# Altium schematic sheet klor1_4_L.SchDoc
size 297 x 209 mm
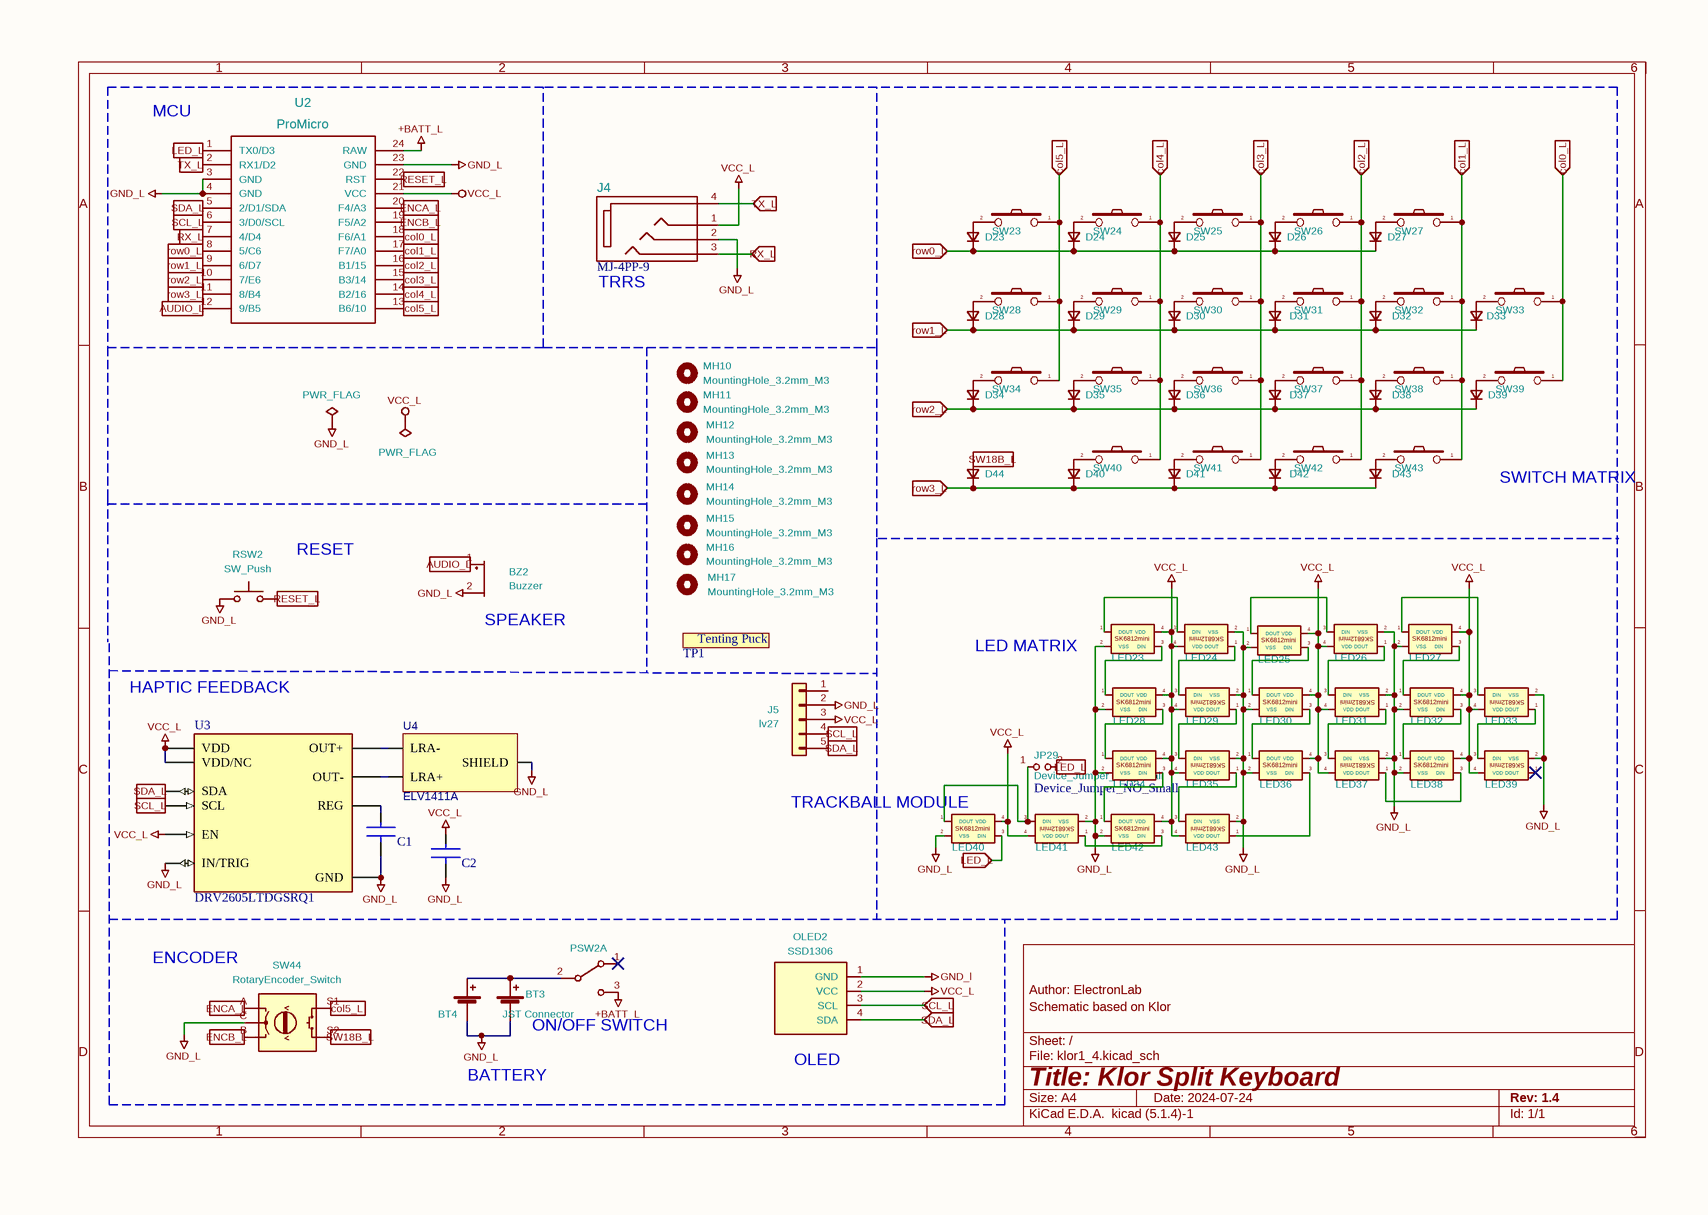
[diagram p0: klor1_4_L.SchDoc]

## Parts
#FLG01  PWR_FLAG  (graphical)
#FLG02  PWR_FLAG  (graphical)
BT3  JST Connector  [JST_PH_2PINS]
BT4  Battery_Cell  [custombatteryconnector_small]  (value not drawn)
BZ2  Buzzer  [Buzzer_Mallory_AST1109MLTRQ_reversible]
C1  Capacitor  [FP-C0402-BB-MFG]  (value not drawn)
C2  Capacitor  [FP-C0402-BB-MFG]  (value not drawn)
D23  D_Small  [Diode_SOD123]  (value not drawn)
D24  D_Small  [Diode_SOD123]  (value not drawn)
D25  D_Small  [Diode_SOD123]  (value not drawn)
D26  D_Small  [Diode_SOD123]  (value not drawn)
D27  D_Small  [Diode_SOD123]  (value not drawn)
D28  D_Small  [Diode_SOD123]  (value not drawn)
D29  D_Small  [Diode_SOD123]  (value not drawn)
D30  D_Small  [Diode_SOD123]  (value not drawn)
D31  D_Small  [Diode_SOD123]  (value not drawn)
D32  D_Small  [Diode_SOD123]  (value not drawn)
D33  D_Small  [Diode_SOD123]  (value not drawn)
D34  D_Small  [Diode_SOD123]  (value not drawn)
D35  D_Small  [Diode_SOD123]  (value not drawn)
D36  D_Small  [Diode_SOD123]  (value not drawn)
D37  D_Small  [Diode_SOD123]  (value not drawn)
D38  D_Small  [Diode_SOD123]  (value not drawn)
D39  D_Small  [Diode_SOD123]  (value not drawn)
D40  D_Small  [Diode_SOD123]  (value not drawn)
D41  D_Small  [Diode_SOD123]  (value not drawn)
D42  D_Small  [Diode_SOD123]  (value not drawn)
D43  D_Small  [Diode_SOD123]  (value not drawn)
D44  D_Small  [Diode_SOD123]  (value not drawn)
J4  MJ-4PP-9  [MJ-4PP-9]
J5  value lv27  [lvc27_onlyInput]  (hidden comment: lv2)
JP29  Device_Jumper_NO_Small  [SolderJumper-2_P1.3mm_Open_TrianglePad1.0x1.5mm]
LED23  SK6812MINI-E  [SK6812MINI-E]  (value not drawn)
LED24  SK6812MINI-E  [SK6812MINI-E]  (value not drawn)
LED25  SK6812MINI-E  [SK6812MINI-E]  (value not drawn)
LED26  SK6812MINI-E  [SK6812MINI-E]  (value not drawn)
LED27  SK6812MINI-E  [SK6812MINI-E]  (value not drawn)
LED28  SK6812MINI-E  [SK6812MINI-E]  (value not drawn)
LED29  SK6812MINI-E  [SK6812MINI-E]  (value not drawn)
LED30  SK6812MINI-E  [SK6812MINI-E]  (value not drawn)
LED31  SK6812MINI-E  [SK6812MINI-E]  (value not drawn)
LED32  SK6812MINI-E  [SK6812MINI-E]  (value not drawn)
LED33  SK6812MINI-E  [SK6812MINI-E]  (value not drawn)
LED34  SK6812MINI-E  [SK6812MINI-E]  (value not drawn)
LED35  SK6812MINI-E  [SK6812MINI-E]  (value not drawn)
LED36  SK6812MINI-E  [SK6812MINI-E]  (value not drawn)
LED37  SK6812MINI-E  [SK6812MINI-E]  (value not drawn)
LED38  SK6812MINI-E  [SK6812MINI-E]  (value not drawn)
LED39  SK6812MINI-E  [SK6812MINI-E]  (value not drawn)
LED40  SK6812MINI-E  [SK6812MINI-E]  (value not drawn)
LED41  SK6812MINI-E  [SK6812MINI-E]  (value not drawn)
LED42  SK6812MINI-E  [SK6812MINI-E]  (value not drawn)
LED43  SK6812MINI-E  [SK6812MINI-E]  (value not drawn)
MH10  MountingHole_3.2mm_M3  [MountingHole_3.2mm_M3]
MH11  MountingHole_3.2mm_M3  [MountingHole_3.2mm_M3]
MH12  MountingHole_3.2mm_M3  [MountingHole_3.2mm_M3]
MH13  MountingHole_3.2mm_M3  [MountingHole_3.2mm_M3]
MH14  MountingHole_3.2mm_M3  [MountingHole_3.2mm_M3]
MH15  MountingHole_3.2mm_M3  [MountingHole_3.2mm_M3]
MH16  MountingHole_3.2mm_M3  [MountingHole_3.2mm_M3]
MH17  MountingHole_3.2mm_M3  [MountingHole_3.2mm_M3]
OLED2  SSD1306  [SSD1306_128x64OLED]
PSW2  SW_DPDT_x2  [SW_MSK12C02]  (value not drawn)  (part A of 2)
RSW2  SW_Push  [SW_Push_1P1T-MP_NO_Horizontal_Alps_SKRTLAE010_both_sides]
SW23  SW_PUSH-MX  [CHERRY-CPG151101S11]  (value not drawn)
SW24  SW_PUSH-MX  [CHERRY-CPG151101S11]  (value not drawn)
SW25  SW_PUSH-MX  [CHERRY-CPG151101S11]  (value not drawn)
SW26  SW_PUSH-MX  [CHERRY-CPG151101S11]  (value not drawn)
SW27  SW_PUSH-MX  [CHERRY-CPG151101S11]  (value not drawn)
SW28  SW_PUSH-MX  [CHERRY-CPG151101S11]  (value not drawn)
SW29  SW_PUSH-MX  [CHERRY-CPG151101S11]  (value not drawn)
SW30  SW_PUSH-MX  [CHERRY-CPG151101S11]  (value not drawn)
SW31  SW_PUSH-MX  [CHERRY-CPG151101S11]  (value not drawn)
SW32  SW_PUSH-MX  [CHERRY-CPG151101S11]  (value not drawn)
SW33  SW_PUSH-MX  [CHERRY-CPG151101S11]  (value not drawn)
SW34  SW_PUSH-MX  [CHERRY-CPG151101S11]  (value not drawn)
SW35  SW_PUSH-MX  [CHERRY-CPG151101S11]  (value not drawn)
SW36  SW_PUSH-MX  [CHERRY-CPG151101S11]  (value not drawn)
SW37  SW_PUSH-MX  [CHERRY-CPG151101S11]  (value not drawn)
SW38  SW_PUSH-MX  [CHERRY-CPG151101S11]  (value not drawn)
SW39  SW_PUSH-MX  [CHERRY-CPG151101S11]  (value not drawn)
SW40  SW_PUSH-MX  [CHERRY-CPG151101S11]  (value not drawn)
SW41  SW_PUSH-MX  [CHERRY-CPG151101S11]  (value not drawn)
SW42  SW_PUSH-MX  [CHERRY-CPG151101S11]  (value not drawn)
SW43  SW_PUSH-MX  [CHERRY-CPG151101S11]  (value not drawn)
SW44  RotaryEncoder_Switch  [RotaryEncoder_Alps_EC11E-Switch_Vertical_H20mm-keebio_modified]
TP1  tenting-puck  [SplitkbTentingPuckWithoutCenterHole]  (value not drawn)
U2  ProMicro  [ProMicro]
U3  DRV2605LTDGSRQ1  [FP-DGS0010A-MFG]
U4  ELV1411A  [SMD-16_ELV1411A]

## Ports
AUDIO_L (in), col0_L (in), col1_L (in), col2_L (in), col3_L (in), col4_L (in), col5_L (in), ENCA_L (in), ENCB_L (in), LED_L (in), RESET_L (in), row0_L (in), row1_L (in), row2_L (in), row3_L (in), RX_L (in), SCL_L (in), SDA_L (in), SW18B_L (in), TX_L (in)

## Nets
+BATT_L: PSW2.3(C) U2.24(RAW)
GND_L: #FLG01.1(pwr) BT3.2(-) BT4.2(-) BZ2.2(+) C1.2 C2.2 J4.2 J5.2(Pin_2) LED23.2(VSS) LED24.2(VSS) LED25.2(VSS) LED26.2(VSS) LED27.2(VSS) LED28.2(VSS) LED29.2(VSS) LED30.2(VSS) LED31.2(VSS) LED32.2(VSS) LED33.2(VSS) LED34.2(VSS) LED35.2(VSS) LED36.2(VSS) LED37.2(VSS) LED38.2(VSS) LED39.2(VSS) LED40.2(VSS) LED41.2(VSS) LED42.2(VSS) LED43.2(VSS) OLED2.1(GND) RSW2.1 SW44.C U2.3(GND) U2.4(GND) U2.23(GND) U3.4(IN/TRIG) U3.8(GND) U4.5,6,7,8,9,10,11,12,13,14,15,16(SHIELD)
VCC_L: #FLG02.1(pwr) C2.1 J4.1 J5.3(Pin_3) LED23.4(VDD) LED24.4(VDD) LED25.4(VDD) LED26.4(VDD) LED27.4(VDD) LED28.4(VDD) LED29.4(VDD) LED30.4(VDD) LED31.4(VDD) LED32.4(VDD) LED33.4(VDD) LED34.4(VDD) LED35.4(VDD) LED36.4(VDD) LED37.4(VDD) LED38.4(VDD) LED39.4(VDD) LED40.4(VDD) LED41.4(VDD) LED42.4(VDD) LED43.4(VDD) OLED2.2(VCC) U2.21(VCC) U3.5(EN) U3.6(VDD/NC) U3.10(VDD)
AUDIO_L: BZ2.1(-) U2.12(9/B5) ; port AUDIO_L
col0_L: SW33.1 SW39.1 U2.18(F6/A1) ; port col0_L
col1_L: SW27.1 SW32.1 SW38.1 SW43.1 U2.17(F7/A0) ; port col1_L
col2_L: SW26.1 SW31.1 SW37.1 SW42.1 U2.16(B1/15) ; port col2_L
col3_L: SW25.1 SW30.1 SW36.1 SW41.1 U2.15(B3/14) ; port col3_L
col4_L: SW24.1 SW29.1 SW35.1 SW40.1 U2.14(B2/16) ; port col4_L
col5_L: SW23.1 SW28.1 SW34.1 SW44.S1 U2.13(B6/10) ; port col5_L
ENCA_L: SW44.A U2.20(F4/A3) ; port ENCA_L
ENCB_L: SW44.B U2.19(F5/A2) ; port ENCB_L
LED_L: JP29.2 LED40.3(DIN) U2.1(TX0/D3) ; port LED_L
RESET_L: RSW2.2 U2.22(RST) ; port RESET_L
row0_L: D23.1(K) D24.1(K) D25.1(K) D26.1(K) D27.1(K) U2.8(5/C6) ; port row0_L
row1_L: D28.1(K) D29.1(K) D30.1(K) D31.1(K) D32.1(K) D33.1(K) U2.9(6/D7) ; port row1_L
row2_L: D34.1(K) D35.1(K) D36.1(K) D37.1(K) D38.1(K) D39.1(K) U2.10(7/E6) ; port row2_L
row3_L: D40.1(K) D41.1(K) D42.1(K) D43.1(K) D44.1(K) U2.11(8/B4) ; port row3_L
RX_L: J4.3 U2.7(4/D4) ; port RX_L
SCL_L: J5.4(Pin_4) OLED2.3(SCL) U2.6(3/D0/SCL) U3.2(SCL) ; port SCL_L
SDA_L: J5.5(Pin_5) OLED2.4(SDA) U2.5(2/D1/SDA) U3.3(SDA) ; port SDA_L
SW18B_L: D44.2(A) SW44.S2 ; port SW18B_L
TX_L: J4.4 U2.2(RX1/D2) ; port TX_L
NetBT3_1: BT3.1(+) BT4.1(+) PSW2.2(B)
NetC1_1: C1.1 U3.1(REG)
NetD23_2: D23.2(A) SW23.2
NetD24_2: D24.2(A) SW24.2
NetD25_2: D25.2(A) SW25.2
NetD26_2: D26.2(A) SW26.2
NetD27_2: D27.2(A) SW27.2
NetD28_2: D28.2(A) SW28.2
NetD29_2: D29.2(A) SW29.2
NetD30_2: D30.2(A) SW30.2
NetD31_2: D31.2(A) SW31.2
NetD32_2: D32.2(A) SW32.2
NetD33_2: D33.2(A) SW33.2
NetD34_2: D34.2(A) SW34.2
NetD35_2: D35.2(A) SW35.2
NetD36_2: D36.2(A) SW36.2
NetD37_2: D37.2(A) SW37.2
NetD38_2: D38.2(A) SW38.2
NetD39_2: D39.2(A) SW39.2
NetD40_2: D40.2(A) SW40.2
NetD41_2: D41.2(A) SW41.2
NetD42_2: D42.2(A) SW42.2
NetD43_2: D43.2(A) SW43.2
NetJP29_1: JP29.1 LED40.1(DOUT) LED41.3(DIN)
NetLED23_1: LED23.1(DOUT) LED24.3(DIN)
NetLED23_3: LED23.3(DIN) LED28.1(DOUT)
NetLED24_1: LED24.1(DOUT) LED29.3(DIN)
NetLED25_1: LED25.1(DOUT) LED26.3(DIN)
NetLED25_3: LED25.3(DIN) LED30.1(DOUT)
NetLED26_1: LED26.1(DOUT) LED31.3(DIN)
NetLED27_1: LED27.1(DOUT) LED33.3(DIN)
NetLED27_3: LED27.3(DIN) LED32.1(DOUT)
NetLED28_3: LED28.3(DIN) LED34.1(DOUT)
NetLED29_1: LED29.1(DOUT) LED35.3(DIN)
NetLED30_3: LED30.3(DIN) LED36.1(DOUT)
NetLED31_1: LED31.1(DOUT) LED37.3(DIN)
NetLED32_3: LED32.3(DIN) LED38.1(DOUT)
NetLED33_1: LED33.1(DOUT) LED39.3(DIN)
NetLED34_3: LED34.3(DIN) LED42.1(DOUT)
NetLED35_1: LED35.1(DOUT) LED43.3(DIN)
NetLED36_3: LED36.3(DIN) LED43.1(DOUT)
NetLED37_1: LED37.1(DOUT) LED38.3(DIN)
NetLED41_1: LED41.1(DOUT) LED42.3(DIN)
NetU3_7: U3.7(OUT+) U4.1,2(LRA-)
NetU3_9: U3.9(OUT-) U4.3,4(LRA+)

Not connected (* = marked no-connect by the designer): J5 1(Pin_1); LED39 1(DOUT)*; PSW2 1(A)*

## Notes on the sheet
- MCU
- TRRS
- SWITCH
  MATRIX
- (near RSW2) RESET
- (near BZ2) SPEAKER
- (near U3) HAPTIC FEEDBACK
- LED
  MATRIX
- (near LED40) TRACKBALL
  MODULE
- ENCODER
- BATTERY
- ON/OFF SWITCH
- (near OLED2) OLED
- 1
- 2
- 3
- 4
- 5
- 6
- A
- B
- C
- Schematic based on Klor
- Author: ElectronLab
- D
- Title: Klor Split Keyboard
- File: klor1_4.kicad_sch
- Sheet: /
- KiCad E.D.A.  kicad (5.1.4)-1
- Size: A4
- Date: 2024-07-24
- Rev: 1.4
- Id: 1/1
- (in symbol LED-SK6812MINI-E) SK6812mini
- (in symbol tenting-puck) Tenting Puck

## Library data of the parts
BT3 = Battery_Cell: Conn Shrouded Header (4 Sides) HDR 2 POS 2mm Solder RA Side Entry Thru-Hole Box; Manufacturer Part Number: S2B-PH-K-S(LF)(SN); Value: JST Connector; Footprint: KLOR:JST_PH_reversible; Supplier: LCSC; Supplier Part Number: C173752; Manufacturer: JST; ComponentLink1URL: https://datasheet.octopart.com:443/S2B-PH-K-S%28LF%29%28SN%29-JST-datasheet-180491669.pdf?src-supplier=IHS; ComponentLink1Description: https://datasheet.octopart.com:443/S2B-PH-K-S%28LF%29%28SN%29-JST-datasheet-180491669.pdf?src-supplier=IHS; ComponentLink2URL: https://datasheet.octopart.com:443/S2B-PH-K-S%28LF%29%28SN%29-JST-datasheet-10411123.pdf?src-supplier=Upverter; ComponentLink2Description: https://datasheet.octopart.com:443/S2B-PH-K-S%28LF%29%28SN%29-JST-datasheet-10411123.pdf?src-supplier=Upverter; ComponentLink3URL: https://datasheet.octopart.com:443/S2B-PH-K-S%28LF%29%28SN%29-JST-datasheet-8324864.pdf?src-supplier=Upverter; ComponentLink3Description: https://datasheet.octopart.com:443/S2B-PH-K-S%28LF%29%28SN%29-JST-datasheet-8324864.pdf?src-supplier=Upverter; ComponentLink4URL: https://datasheet.octopart.com:443/S2B-PH-K-S%28LF%29%28SN%29-JST-datasheet-56537.pdf?src-supplier=Upverter; ComponentLink4Description: https://datasheet.octopart.com:443/S2B-PH-K-S%28LF%29%28SN%29-JST-datasheet-56537.pdf?src-supplier=Upverter; ComponentLink5URL: https://datasheet.octopart.com:443/S2B-PH-K-S%28LF%29%28SN%29-JST-datasheet-15068535.pdf?src-supplier=Upverter; ComponentLink5Description: https://datasheet.octopart.com:443/S2B-PH-K-S%28LF%29%28SN%29-JST-datasheet-15068535.pdf?src-supplier=Upverter; ComponentLink6URL: https://datasheet.octopart.com:443/S2B-PH-K-S%28LF%29%28SN%29-JST-datasheet-147762421.pdf?src-supplier=LKR; ComponentLink6Description: https://datasheet.octopart.com:443/S2B-PH-K-S%28LF%29%28SN%29-JST-datasheet-147762421.pdf?src-supplier=LKR; ComponentLink7URL: https://datasheet.octopart.com:443/S2B-PH-K-S%28LF%29%28SN%29-JST-datasheet-12510261.pdf?src-supplier=Future+Electronics; ComponentLink7Description: https://datasheet.octopart.com:443/S2B-PH-K-S%28LF%29%28SN%29-JST-datasheet-12510261.pdf?src-supplier=Future+Electronics
BZ2 = Buzzer: 70dB Passive (external drive) Piezoelectric SMD, 9x11mm Buzzers ROHS; Manufacturer: KELIKING; Value: Buzzer; Footprint: KLOR:Buzzer_Mallory_AST1109MLTRQ_reversible; Supplier: LCSC; Supplier Part Number: C201047; Manufacturer Part Number: KLJ-1102; Category: Uncategorized; Stock: 1162; Pricing: 1=0.6575, 10=0.5231, 30=0.4559, 100=0.3887, 500=0.3488, 1000=0.328 (USD)
C1 C2 = Capacitor: Manufacturer: CCTC; Manufacturer Part Number: TCC0402X5R105M100AT; Category: Ceramic Capacitors; Supplier Part Number: C2887020; Supplier: LCSC
D23-D44 = D_Small: Switching Diodes (Small Signal) SOD123 IR=5μA Io=150mA; Manufacturer: Slkor; Manufacturer Part Number: 1N4148W; Value: D_Small; Footprint: KLOR:Diode_SOD123; Supplier: LCSC; Supplier Part Number: C444720; Category: Rectifier Diodes; Stock: 1538400; Pricing: 100=0.006, 1000=0.0047, 3000=0.0037, 9000=0.0033, 51000=0.0031, 99000=0.003 (USD)
J4 = MJ-4PP-9 TRRS: -20⊥~+70⊥ 3.5mm Headphone Jack 235⊥ 30V 500mA Plugin Audio Connectors (Headphones) ROHS; Manufacturer: XKB Connectivity; Manufacturer Part Number: PJ-320A; Supplier: LCSC; Supplier Part Number: C22459514; Category: Uncategorized; JLCPCB Part #: C22459514
J5 = Conn_01x05: Footprint: KLOR:lvc27_onlyInput
JP29 = Device_Jumper_NO_Small: ki_fp_filters: SolderJumper*Open*; Value: Device_Jumper_NO_Small
LED23-LED43 = LED-SK6812MINI-E: Conn Shrouded Header (4 Sides) HDR 2 POS 2mm Solder RA Side Entry Thru-Hole Box; Manufacturer: DONGGUAN OCCIDENTAL OPTOELECTRONICS; Category: Uncategorized; Manufacturer Part Number: SK6812MINI-E; Supplier: LCSC; Supplier Part Number: C5149201
MH10-MH17 = MountingHole: Value: MountingHole_3.2mm_M3; Footprint: MountingHole:MountingHole_3.2mm_M3
PSW2 = SW_DPDT_x2: Slide Switches SPDT switch length: 8mm, switch width: 2.8mm; Manufacturer: SHOU HAN; Manufacturer Part Number: MSK12C02; Value: SW_DPDT_x2; Footprint: KLOR:MSK12C02_reversible; Supplier: LCSC; Supplier Part Number: C431540; Category: Uncategorized; Stock: 128790; Pricing: 10=0.0566, 100=0.0464, 300=0.0411, 3000=0.0353, 6000=0.0338, 9000=0.0328 (USD)
RSW2 = SW_Push: Tactile Switch, SKRT, Side Actuated, Surface Mount, Round Button, 160 gf, 50mA at 12VDC; Manufacturer: ALPSALPINE; Manufacturer Part Number: SKRTLAE010; Value: SW_Push; Footprint: KLOR:SW_Push_1P1T-MP_NO_Horizontal_Alps_SKRTLAE010_both_sides; Supplier: LCSC; Supplier Part Number: C110293; Category: Uncategorized; Stock: 34920; Pricing: 5=0.1324, 50=0.1079, 150=0.0956, 500=0.0864, 3000=0.0737, 6000=0.0701 (USD)
SW23-SW43 = SW_PUSH-MX_SOCKET: Manufacturer: HanElectricity; Manufacturer Part Number: CPG151101S11-16; Supplier: LCSC; Category: Uncategorized; Supplier Part Number: C41430893
SW44 = RotaryEncoder_Switch: Mechanical Encoder Rotary Incremental Flat 0.01N.m Straight Quadrature Digital Square Wave 15PPR Through Hole PC Pin...; Manufacturer: ALPSALPINE; Manufacturer Part Number: EC11N1525404; Value: RotaryEncoder_Switch; Footprint: KLOR:RotaryEncoder_Alps_EC11E-Switch_Vertical_H20mm-keebio_modified; Supplier: LCSC; Supplier Part Number: C470748; Category: Decoders and Multiplexers; Stock: 3732; Pricing: 1=2.7421, 10=2.3608, 30=2.1232, 120=1.7807, 480=1.6708, 960=1.6223, 2040=1.6046, 4800=1.5916 (USD)
U3 = DRV2605: IC MOTOR DRIVER 2V-5.2V 10VSSOP; Manufacturer: TI; Manufacturer Part Number: DRV2605LDGST; Logic Function: AND GATE; Min Supply Voltage: 2V; Max Supply Voltage: 5.2V; Quiescent Current: 500uA; Interface: I2C; Min Operating Temperature: -40°C; RoHS Compliant: Yes; Max Operating Temperature: 105°C; Case/Package: VSSOP; REACH SVHC: No SVHC; Packaging: Cut Tape; Number of Pins: 10; Mount: Surface Mount; Lead Free: Lead Free; Supplier Part Number: C425927; Supplier: LCSC
U4 = ELV1411A: 11mm x 14mm Rectangular Linear Vibration Motor Model NFP-ELV1411A-A1; Manufacturer: JLCPCB Assembly; Contributor: lcsc; Supplier: LCSC; JLCPCB Part Class: Extended Part; spicePre: U; spiceSymbolName: ELV1411A; Supplier Part Number: C9900029336; Manufacturer Part Number: ELV1411A
#FLG01 #FLG02 = PWR_FLAG: Value: PWR_FLAG
BT4 = Battery_Cell: Value: Battery_Cell; Footprint: KLOR:custombatteryconnector_small
OLED2 = SSD1306: Value: SSD1306; Footprint: KLOR:SSD1306_128x64OLED
U2 = ProMicro: Value: ProMicro; Footprint: KLOR:ProMicro